# Altium schematic sheet Holder_Accu.SchDoc
size A4; SheetNumber: 1; SheetTotal: 1
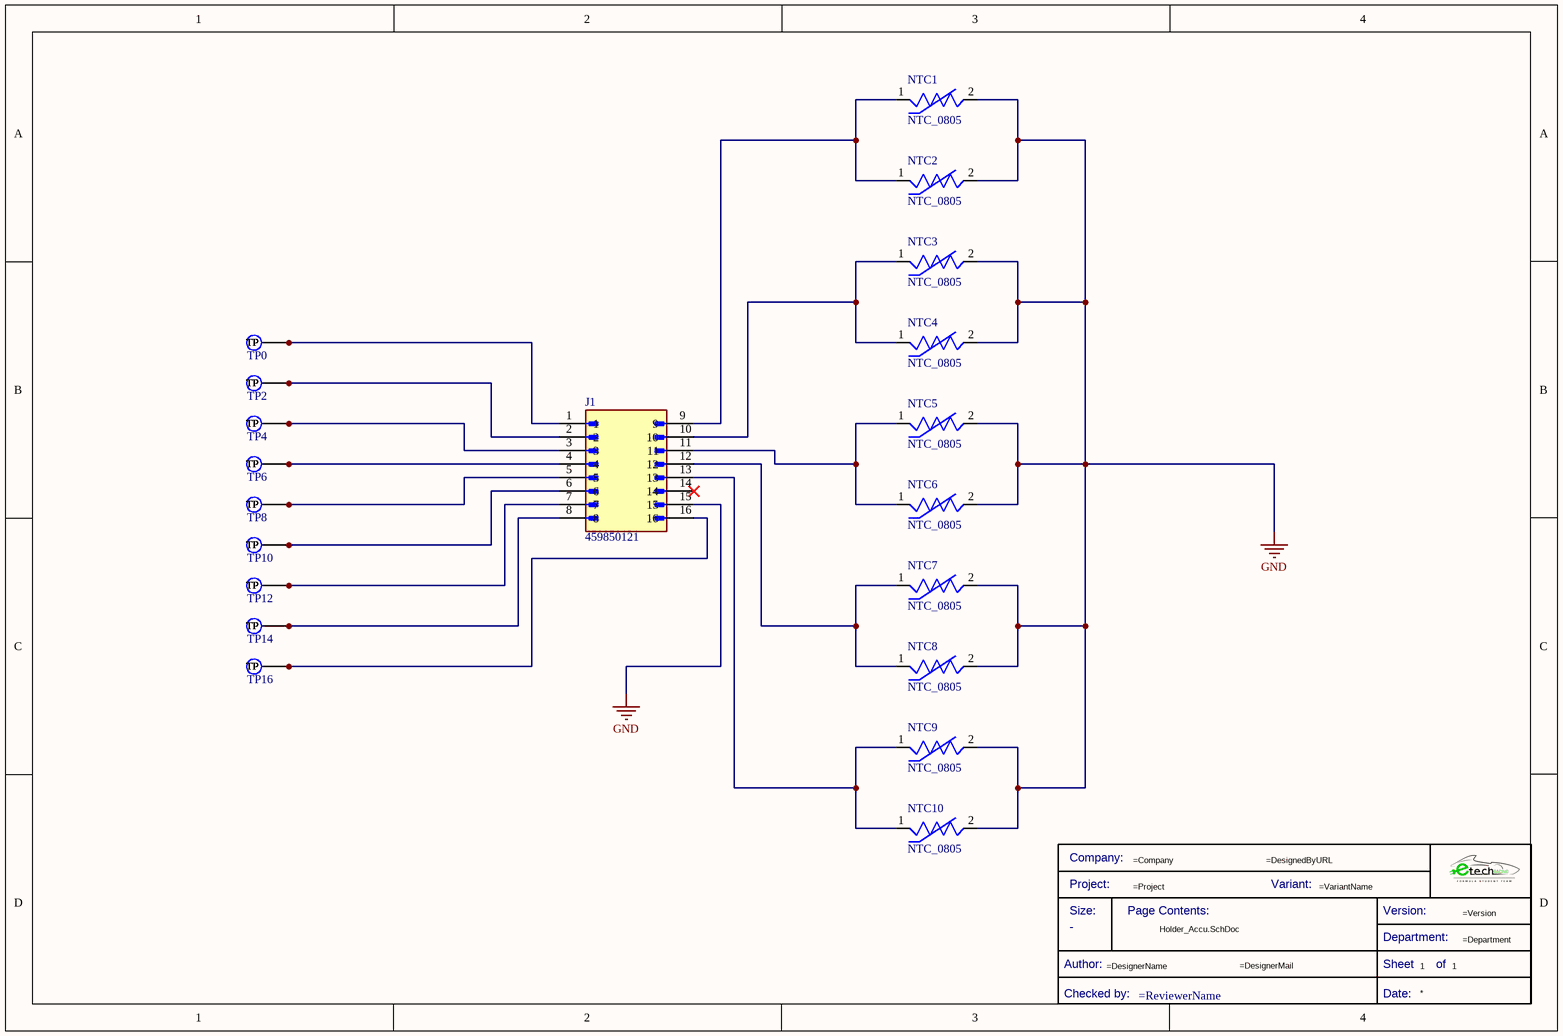
[diagram p0: Holder_Accu.SchDoc]

## Parts
*  Title Block_template  (value not drawn)  (graphical)
J1  459850121  [MOLEX_459850121]
NTC1  NTC_0805  [NTC_0805]
NTC2  NTC_0805  [NTC_0805]
NTC3  NTC_0805  [NTC_0805]
NTC4  NTC_0805  [NTC_0805]
NTC5  NTC_0805  [NTC_0805]
NTC6  NTC_0805  [NTC_0805]
NTC7  NTC_0805  [NTC_0805]
NTC8  NTC_0805  [NTC_0805]
NTC9  NTC_0805  [NTC_0805]
NTC10  NTC_0805  [NTC_0805]
TP0  Test Point  [TESTPOINT_WIDE]  (value not drawn)
TP2  Test Point  [TESTPOINT_WIDE]  (value not drawn)
TP4  Test Point  [TESTPOINT_WIDE]  (value not drawn)
TP6  Test Point  [TESTPOINT_WIDE]  (value not drawn)
TP8  Test Point  [TESTPOINT_WIDE]  (value not drawn)
TP10  Test Point  [TESTPOINT_WIDE]  (value not drawn)
TP12  Test Point  [TESTPOINT_WIDE]  (value not drawn)
TP14  Test Point  [TESTPOINT_WIDE]  (value not drawn)
TP16  Test Point  [TESTPOINT_WIDE]  (value not drawn)

## Nets
GND: J1.15 NTC1.2 NTC2.2 NTC3.2 NTC4.2 NTC5.2 NTC6.2 NTC7.2 NTC8.2 NTC9.2 NTC10.2
NetJ1_1: J1.1 TP0.1(TP)
NetJ1_2: J1.2 TP2.1(TP)
NetJ1_3: J1.3 TP4.1(TP)
NetJ1_4: J1.4 TP6.1(TP)
NetJ1_5: J1.5 TP8.1(TP)
NetJ1_6: J1.6 TP10.1(TP)
NetJ1_7: J1.7 TP12.1(TP)
NetJ1_8: J1.8 TP14.1(TP)
NetJ1_9: J1.9 NTC1.1 NTC2.1
NetJ1_10: J1.10 NTC3.1 NTC4.1
NetJ1_11: J1.11 NTC5.1 NTC6.1
NetJ1_12: J1.12 NTC7.1 NTC8.1
NetJ1_13: J1.13 NTC9.1 NTC10.1
NetJ1_16: J1.16 TP16.1(TP)

Not connected (* = marked no-connect by the designer): J1 14*

## Notes on the sheet
- (in symbol Title Block_template) Company:; Project:; Variant:; Size:; Page Contents:; Version:; Department:; Author:; Sheet; of; Checked by:; Date:

## Library data of the parts
* = Title Block_template: Standard Title Block; .Creator: GP; Category: Title Block; .PCBcheck: GP; .SCHcheck: GP; Checked by:: =ReviewerName; Size: -
NTC1-NTC10 = NTC_0805: NTC Thermistor 10k 0805 (2012 Metric); MF: TDK Corporation; MP: NTCG203NH103JTDS; SnapEDA_Link: https://www.snapeda.com/parts/NTCG203NH103JTDS/TDK/view-part/?ref=snap; Package: 0805 TDK; Value: *; Check_prices: https://www.snapeda.com/parts/NTCG203NH103JTDS/TDK/view-part/?ref=eda
TP0 TP2 TP4 TP6 TP8 TP10 TP12 TP14 TP16 = TestPoint_Wide: TestPoint 5x5mm
J1 = 459850121: Price: None; MP: 459850121; Value: *; Availability: Unavailable; Package: None